# EAGLE design 1-BitSelect (EAGLE 7.4.0)
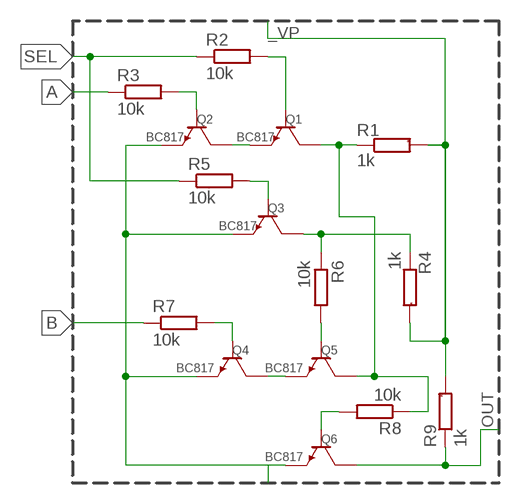
[diagram p0: schematic, sheet 1]

## Parts
Q1  BC817  TRANSISTOR-NPN-GENERICDEFAULT-SOT23-BEC  [SOT23]
Q2  BC817  TRANSISTOR-NPN-GENERICDEFAULT-SOT23-BEC  [SOT23]
Q3  BC817  TRANSISTOR-NPN-GENERICDEFAULT-SOT23-BEC  [SOT23]
Q4  BC817  TRANSISTOR-NPN-GENERICDEFAULT-SOT23-BEC  [SOT23]
Q5  BC817  TRANSISTOR-NPN-GENERICDEFAULT-SOT23-BEC  [SOT23]
Q6  BC817  TRANSISTOR-NPN-GENERICDEFAULT-SOT23-BEC  [SOT23]
R1  1k  R-EU-MARKEDR0603  [R0603-MARK]
R2  10k  R-EU_R0603  [R0603]
R3  10k  R-EU_R0603  [R0603]
R4  1k  R-EU-MARKEDR0603  [R0603-MARK]
R5  10k  R-EU_R0603  [R0603]
R6  10k  R-EU_R0603  [R0603]
R7  10k  R-EU_R0603  [R0603]
R8  10k  R-EU_R0603  [R0603]
R9  1k  R-EU-MARKEDR0603  [R0603-MARK]

## Nets
_VN: Q2.P$2(EMITTER) Q3.P$2(EMITTER) Q4.P$2(EMITTER) Q6.P$2(EMITTER)
_VP: R1.2 R4.2 R9.2
A: R3.1
B: R7.1
I-S2: Q3.P$3(COLLECTOR) R4.1 R6.1
N$53: Q1.P$1(BASE) R2.2
N$55: Q2.P$1(BASE) R3.2
N$56: Q1.P$2(EMITTER) Q2.P$3(COLLECTOR)
N$57: Q5.P$1(BASE) R6.2
N$58: Q4.P$1(BASE) R7.2
N$59: Q4.P$3(COLLECTOR) Q5.P$2(EMITTER)
N$60: Q6.P$1(BASE) R8.2
N$62: Q3.P$1(BASE) R5.2
OUT: Q6.P$3(COLLECTOR) R9.1
SEL: R2.1 R5.1
SEL_INT1: Q1.P$3(COLLECTOR) Q5.P$3(COLLECTOR) R1.1 R8.1

## Library data of the parts
Q1-Q6 = p.peter-gator:TRANSISTOR-NPN-GENERIC; SV_SPICE_MODEL: NPN (); SV_SPICE_ORDER: COLLECTOR;BASE;EMITTER; SV_SPICE_PREFIX: Q
R1 R4 R9 = p.peter-rcl:R-EU-MARKED
R2 R3 R5-R8 = p.peter-gator:R-EU_: RESISTOR, European symbol; SV_SPICE_ORDER: 1;2; SV_SPICE_PREFIX: R

## Board
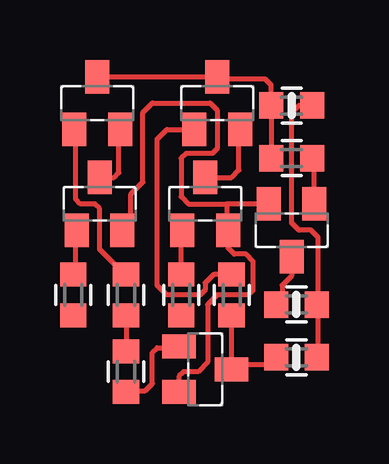
[diagram p1: board, top side]
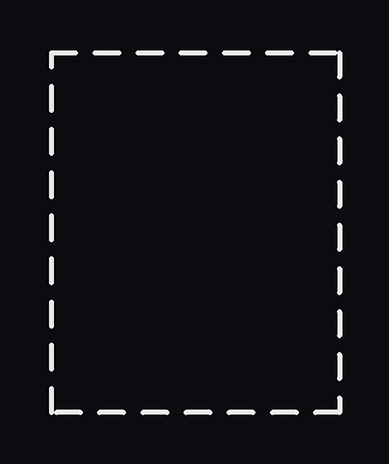
[diagram p2: board, bottom side, seen from below]

No outline drawn. Coordinates in mm, seen from the top.
Copper layers (1*16): Top 0.035mm / dielectric 1.5mm / Bottom 0.035mm
Design rules "Fusion_eagle_rule_v1.1 *": minimum track width 6mil, minimum drill 12mil, track to track 6mil, track to pad 6mil, pad to pad 6mil, via to via 6mil, smd to smd 0mil, copper to edge 10mil, drill to drill 10mil, minimum pad ring 15mil, minimum via ring 6mil, stop-mask expansion 2mil, vias tented up to drill 100mil, thermal gap 10mil

### Footprints (pad centres in the part's own frame; a part is rotated, then mirrored left to right if it is on the bottom)
SOT23 = smd 1 x 1.4: P$1 -0.95,-1.1; P$2 0.95,-1.1; P$3 0,1.1
R0603-MARK = smd 1 x 1.1: 1 -0.85,0; 2 0.85,0
R0603 = smd 1 x 1.1: 1 -0.85,0; 2 0.85,0

### Placement (x,y rotation side)
Q1  2,12.9 0 top
Q2  2.1,8.7 0 top
Q3  6.5,1.8 270 top
Q4  6.5,8.7 0 top
Q5  7,12.9 0 top
Q6  10.1,7.6 180 top
R1  10.1,12.8 0 top
R2  3.2,4.9 90 top
R3  1,4.9 90 top
R4  10.3,2.3 0 top
R5  3.2,1.7 270 top
R6  7.6,4.9 90 top
R7  5.5,4.9 90 top
R8  10.1,10.6 0 top
R9  10.3,4.5 0 top

### Tracks (layer width: path | path; a pad name or v marks a point on that pad's centre or on a via)
_VN
  Top 0.2: Q4.P$2 7.5,7.8 | Q2.P$2 3.4,7.6 3.4,9.1 3.9,9.6 3.9,12.5 4.3,12.9 6.7,12.9 7,12.6 7,11 6.8,10.8 5.7,10.8 5.5,10.6 5.5,9 5.8,8.7 7.4,8.7 | 7.4,8.7 7.4,7.65 Q4.P$2 | Q4.P$2 7.45,6.85 7.7,6.6 8.2,6.6 8.5,6.3 8.5,5.1 8.3,4.9 7,4.9 6.6,4.5 6.6,2.1 6.2,1.7 5.6,1.7 5.4,1.5 Q3.P$2 5.45,0.7 | Q6.P$2 7.4,8.7
_VP
  Top 0.2: R4.2 11.2,2.3 11.2,2.8 11.2,4.45 R9.2 11.2,4.5 11.2,7.3 10.9,7.6 10.4,7.6 10.1,7.9 10.1,12.5 10.4,12.8 R1.2
A
  Top 0.2: R3.1 1,4 0.9,3.9 | 0.9,3.9 1,3.9 0.9,3.9
B
  Top 0.2: 5.45,4 R7.1
I-S2
  Top 0.2: Q3.P$3 7.8,1.7 8.1,2 | 8.1,2 9.15,2 R4.1 | 8.1,2 7.9,2 Q3.P$3 | Q3.P$3 R6.1
N$53
  Top 0.2: R2.2 3.15,5.75 2.8,6.1 2.4,6.5 2.2,6.7 2.1,6.8 2.1,8.5 1.9,8.7 1.3,8.7 1.1,8.9 1.1,11.75 Q1.P$1
N$55
  Top 0.2: R3.2 1,6 1.1,6.1 1.1,7.55 Q2.P$1
N$56
  Top 0.2: Q2.P$3 2.7,9.8 2.9,10 2.9,11.75 Q1.P$2
N$57
  Top 0.2: Q5.P$1 4.9,11.8 4.5,11.4 4.5,6.6 4.5,5.3 4.9,4.9 6.3,4.9 6.5,5.1 6.5,5.4 6.85,5.75 R6.2
N$58
  Top 0.2: R7.2 5.5,5.7 5.5,7.55 Q4.P$1
N$59
  Top 0.2: Q4.P$3 7.6,9.8 7.9,10.1 7.9,11.75 Q5.P$2
N$60
  Top 0.2: Q6.P$1 11.05,10.5 R8.2
N$62
  Top 0.2: R5.2 3.45,0.85 3.5,0.9 4,0.9 4.3,1.2 4.3,2.5 4.5,2.7 5.35,2.7 Q3.P$1
OUT
  Top 0.2: Q6.P$3 10.1,5.7 9.7,5.3 9.7,4.75 R9.1 9.5,4.45
SEL
  Top 0.2: 3.15,2.5 R5.1 R2.1
SEL_INT1
  Top 0.2: Q1.P$3 2.1,14 Q5.P$3 | 7.1,14.4 6.9,14.2 7,14.1 Q5.P$3 | Q5.P$3 7.1,13.9 9,13.9 9.25,13.65 R1.1 R8.1